# Altium schematic sheet Connectors.SchDoc
size A4; SheetNumber: 1; SheetTotal: 5
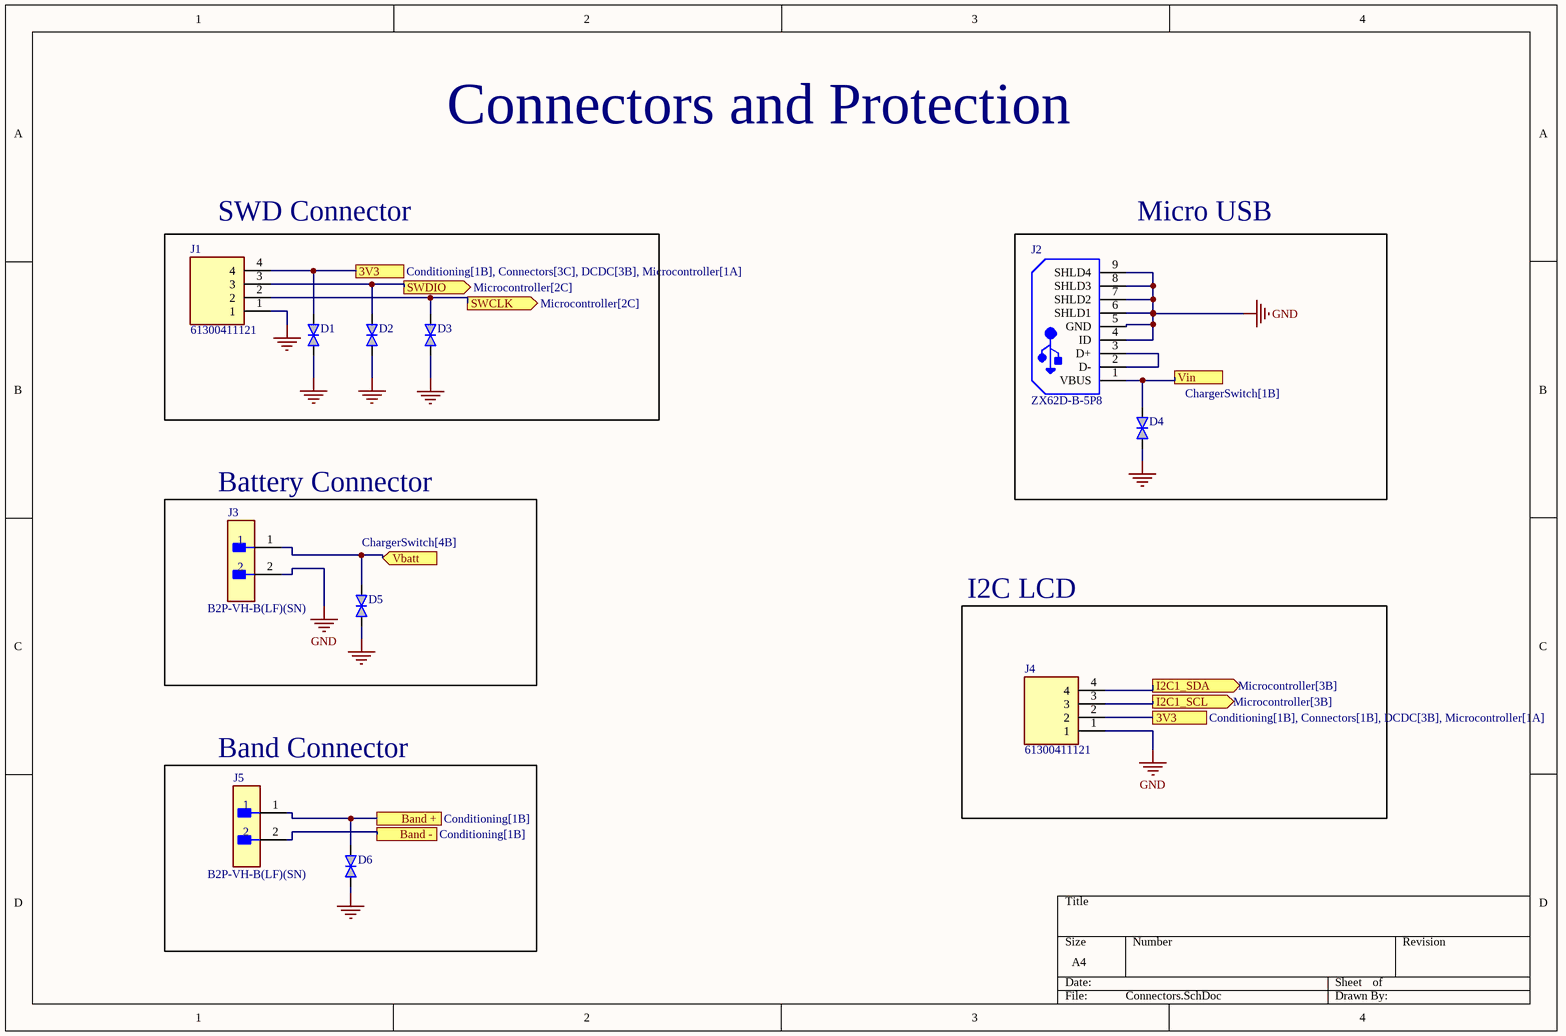
[diagram p0: Connectors.SchDoc]

## Parts
D1  C484328  [1SS357TPH3F]  (value not drawn)
D2  C484328  [1SS357TPH3F]  (value not drawn)
D3  C484328  [1SS357TPH3F]  (value not drawn)
D4  C484328  [1SS357TPH3F]  (value not drawn)
D5  C484328  [1SS357TPH3F]  (value not drawn)
D6  C484328  [1SS357TPH3F]  (value not drawn)
J1  61300411121  [HDRV4W95P0X254_1X4_1016X254X854P]
J2  ZX62D-B-5P8  [HIRO-ZX62D-B-5P8_V]
J3  B2P-VH-B(LF)(SN)  [FP-B2P-VH-B_LF_SN-MFG]
J4  61300411121  [HDRV4W95P0X254_1X4_1016X254X854P]
J5  B2P-VH-B(LF)(SN)  [FP-B2P-VH-B_LF_SN-MFG]

## Blocks framed on the sheet
SWD Connector: D1-D3 J1
Micro USB: D4 J2
Battery Connector: D5 J3
I2C LCD: J4
Band Connector: D6 J5

## Ports
3V3 (see Conditioning[1B], Connectors[1B], DCDC[3B], Microcontroller[1A]), 3V3 (see Conditioning[1B], Connectors[3C], DCDC[3B], Microcontroller[1A]), Band + (see Conditioning[1B]), Band - (see Conditioning[1B]), I2C1_SCL (out, see Microcontroller[3B]), I2C1_SDA (out, see Microcontroller[3B]), SWCLK (out, see Microcontroller[2C]), SWDIO (out, see Microcontroller[2C]), Vbatt (in, see ChargerSwitch[4B]), Vin (see ChargerSwitch[1B])

## Nets
GND: D1.2 D2.2 D3.2 D4.2 D5.2 D6.2 J1.1 J2.4(ID) J2.5(GND) J2.6(SHLD1) J2.7(SHLD2) J2.8(SHLD3) J2.9(SHLD4) J3.2 J4.1
3V3: D1.1 J1.4 J4.2 ; port 3V3
Band +: D6.1 J5.1 ; port Band +
Band -: J5.2 ; port Band -
I2C1_SCL: J4.3 ; port I2C1_SCL
I2C1_SDA: J4.4 ; port I2C1_SDA
SWCLK: D3.1 J1.2 ; port SWCLK
SWDIO: D2.1 J1.3 ; port SWDIO
Vbatt: D5.1 J3.1 ; port Vbatt
Vin: D4.1 J2.1(VBUS) ; port Vin
NetJ2_2: J2.2(D-) J2.3(D+)

## Notes on the sheet
- Connectors and Protection

## Library data of the parts
D1-D6 = CMP-004-00033-2: 13.3V 19V 12V SOD-323  ESD Protection Devices ROHS; Manufacturer_Name: Toshiba; Mouser Price/Stock: https://www.mouser.co.uk/ProductDetail/Toshiba/DF2B36FUH3F?qs=PDgMCp4xDJY7HvoH3U6rfA%3D%3D; Design Item ID: DF2B36FU,H3F; Manufacturer_Part_Number: DF2B36FU,H3F; Height: 1mm; Mouser Part Number: 757-DF2B36FUH3F; Source: SamacSys.SchLib; Datasheet Link: http://toshiba.semicon-storage.com/info/docget.jsp?did=36248&prodName=DF2B36FU; Arrow Part Number: DF2B36FU,H3F; Arrow Price/Stock: https://www.arrow.com/en/products/df2b36fuh3f/toshiba?region=nac
J1 = CMP-002-00071-5: WR-PHD 2.54mm Pin Header THT Straight 4p Wurth Elektronik WR-PHD Series, Series Number 6130, 2.54mm Pitch 4 Way 1 Row Straight PCB Header, Solder Termination; Geometry.Height: 8.54mm; Datasheet Link: http://katalog.we-online.de/em/datasheet/6130xx11121.pdf; Manufacturer_Part_Number: 61300411121; Design Item ID: 61300411121; Source: 61300411121.SchLib; Manufacturer_Name: Wurth Elektronik; Mouser Price/Stock: https://www.mouser.co.uk/ProductDetail/Wurth-Elektronik/61300411121?qs=PhR8RmCirEYQcLLqXD8rAA%3D%3D; Mouser Part Number: 710-61300411121
J2 = CMP-002-00043-2: Right Angle Receptacle Connector, Micro USB, 5 Position, Height 2.65 mm, -30 to 85 degC, RoHS, Tape and Reel; Manufacturer: Hirose Electric; Gender: Male; Rows: 1; Current Rating: 1A; Max Operating Temperature: 85°C; Package Quantity: 2000; Connector Type: USB; Datasheet Version: Aug-16; Contact Material: Copper; Packaging: TapeandReel; Package URL: https://www.hirose.com/product/en/download_file/key_name/ZX62D-B-5P8/category/Drawing%20(2D)/doc_file_id/36535/?file_category_id=6&item_id=02420034000&is_series=; Min Operating Temperature: -30°C; Case/Package: ZX62D-B-5P8; Package Reference: ZX62D-B-5P8; Pins: 5; Mounting Technology: SM; Package Description: USB Connector, 5 Position Surface Mount, Length 8 mm, Height 2.65 mm; Housing Material: Plastic; Datasheet URL: https://www.hirose.com/product/en/download_file/key_name/ZX62D-B-5P8/category/Catalog/doc_file_id/31704/?file_category_id=5&item_id=02420034000&is_series=; Contact Plating: Gold; Lead Pitch: 0.65mm; RoHS Compliant: True; Manufacturer URL: https://www.hirose.com
J3 J5 = CMP-17439-000297-1: CONN HEADER VERT 2POS 3.96MM; Number of Positions: 2; Pitch: 0.156inch; Voltage Rating: 250V; Termination: Solder; Lead Free: Lead Free; Insulation Color: Natural; Contact Material: Brass; Flammability Rating: UL94 V-0; Packaging: Bulk; Contact Mating Length: 0.303inch; Color: Natural; Contact Shape: Square; Contact Plating: Tin; Number of Rows: 1; Insulation Material: PBT; Connector Type: Header; Contact Finish - Mating: TIN; Mount: Through Hole; Fastening Type: Friction; Contact Type: Male Pin; Series: VH
J4 = CMP-002-00071-1: WR-PHD 2.54mm Pin Header THT Straight 4p Wurth Elektronik WR-PHD Series, Series Number 6130, 2.54mm Pitch 4 Way 1 Row Straight PCB Header, Solder Termination; Geometry.Height: 8.54mm; Design Item ID: 61300411121; Datasheet Link: http://katalog.we-online.de/em/datasheet/6130xx11121.pdf; Source: 61300411121.SchLib; Manufacturer_Part_Number: 61300411121; Mouser Price/Stock: https://www.mouser.co.uk/ProductDetail/Wurth-Elektronik/61300411121?qs=PhR8RmCirEYQcLLqXD8rAA%3D%3D; Manufacturer_Name: Wurth Elektronik; Mouser Part Number: 710-61300411121